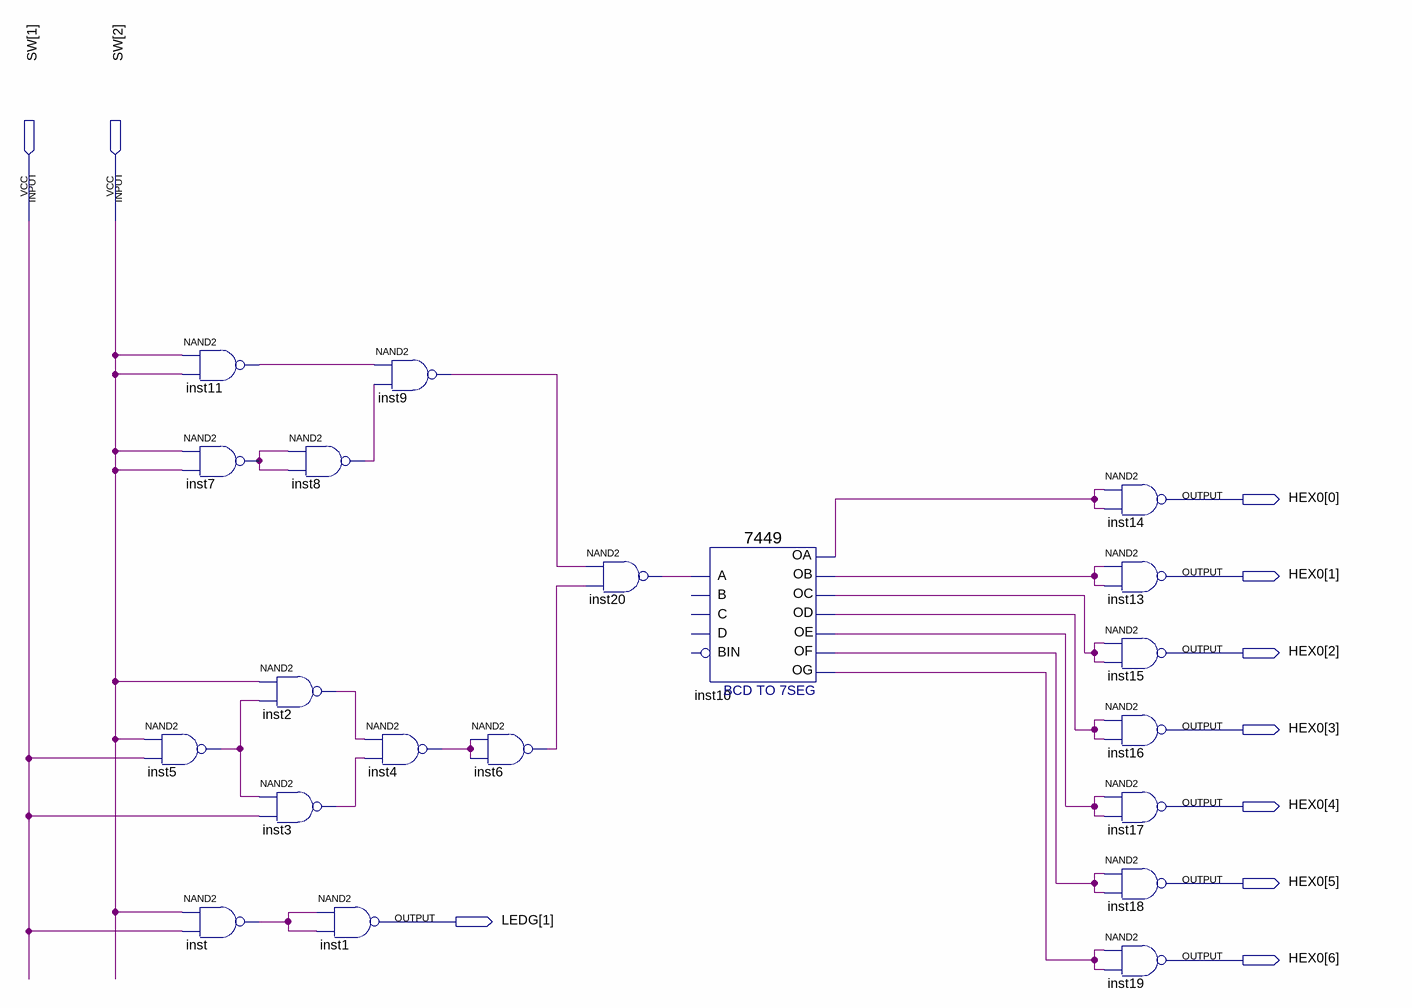
[diagram p0: schematic sheet]
// Quartus schematic Etapa2.bdf as structural Verilog: 20 symbols, 10 pins
module Etapa2 (
  input  [2:1] SW,
  output [6:0] HEX0,
  output [1:1] LEDG
);

  wire inst2_out, inst3_out, inst4_out, inst5_out, inst6_out, inst7_out, inst8_out, inst9_out, inst10_oa,
       inst10_ob, inst10_oc, inst10_od, inst10_oe, inst10_of, inst10_og, inst11_out, inst20_out, inst_out;

  nand inst5 (inst5_out, SW[2], SW[1]);
  nand inst11 (inst11_out, SW[2], SW[2]);
  nand inst7 (inst7_out, SW[2], SW[2]);
  nand inst (inst_out, SW[2], SW[1]);
  nand inst8 (inst8_out, inst7_out, inst7_out);
  nand inst2 (inst2_out, SW[2], inst5_out);
  nand inst3 (inst3_out, inst5_out, SW[1]);
  nand inst9 (inst9_out, inst11_out, inst8_out);
  nand inst4 (inst4_out, inst2_out, inst3_out);
  nand inst1 (LEDG[1], inst_out, inst_out);
  nand inst6 (inst6_out, inst4_out, inst4_out);
  nand inst20 (inst20_out, inst9_out, inst6_out);
  \7449  inst10 (
    .A(inst20_out), .OC(inst10_oc), .OD(inst10_od), .OF(inst10_of), .OG(inst10_og), .OB(inst10_ob),
    .OA(inst10_oa), .OE(inst10_oe));  // open: C, B, D, BIN
  nand inst14 (HEX0[0], inst10_oa, inst10_oa);
  nand inst13 (HEX0[1], inst10_ob, inst10_ob);
  nand inst15 (HEX0[2], inst10_oc, inst10_oc);
  nand inst16 (HEX0[3], inst10_od, inst10_od);
  nand inst17 (HEX0[4], inst10_oe, inst10_oe);
  nand inst18 (HEX0[5], inst10_of, inst10_of);
  nand inst19 (HEX0[6], inst10_og, inst10_og);
endmodule
